# EAGLE design Probatio_Pogo (EAGLE 8.2.1)
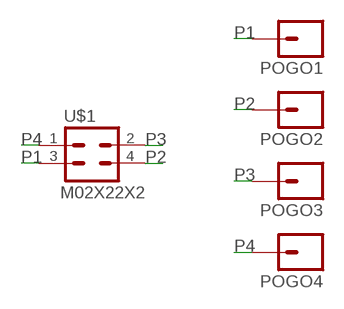
[diagram p0: schematic, sheet 1]

## Parts
POGO1  POGO_PIN0900-0-15-20-76-14-11-0  [POGO_PIN]
POGO2  POGO_PIN0900-0-15-20-76-14-11-0  [POGO_PIN]
POGO3  POGO_PIN0900-0-15-20-76-14-11-0  [POGO_PIN]
POGO4  POGO_PIN0900-0-15-20-76-14-11-0  [POGO_PIN]
U$1  M02X22X2  [2X2]

## Nets
P1: POGO1.P$1 U$1.3
P2: POGO2.P$1 U$1.4
P3: POGO3.P$1 U$1.2
P4: POGO4.P$1 U$1.1

## Library data of the parts
POGO1-POGO4 = Batebit:POGO_PIN
U$1 = Batebit:M02X2

## Net classes
0 default: width 0.4 mm, drill 0.8 mm, clearance 0.2 mm

## Board
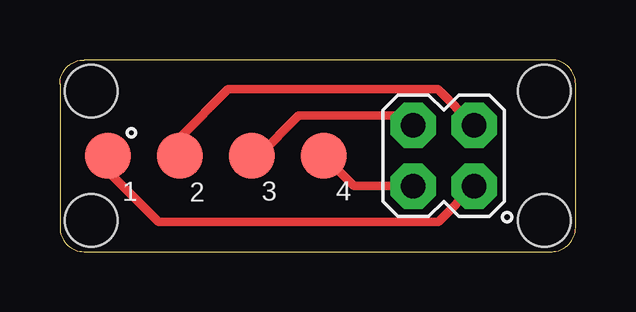
[diagram p1: board, top side]
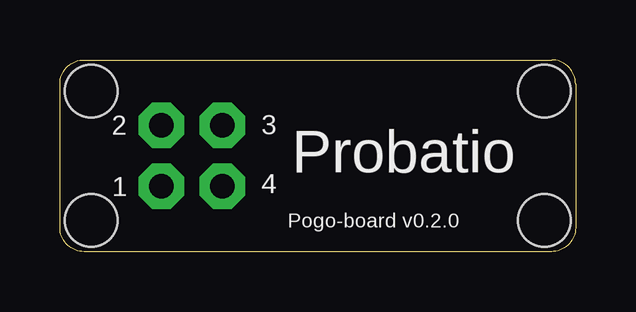
[diagram p2: board, bottom side, seen from below]

Size 21.5 x 8 mm. Coordinates in mm from the lower left corner, seen from the top.
Outline: 21.5,1 21.5,7 arc90 20.5,8 1,8 arc90 0,7 0,1 arc90 1,0 20.5,0 arc90 21.5,1
Copper layers (1*16): Top 0.035mm / dielectric 1.5mm / Bottom 0.035mm
Design rules "default *": minimum track width 8mil, minimum drill 0.35mm, track to track 8mil, track to pad 8mil, pad to pad 8mil, via to via 8mil, smd to smd 8mil, copper to edge 40mil, drill to drill 6mil, minimum pad ring 10mil, minimum via ring 8mil, stop-mask expansion 4mil, vias tented up to drill 0mil, thermal gap 10mil
Holes 2.2 mm at 20.2,1.3 20.2,6.7 1.3,6.7 1.3,1.3

### Footprints (pad centres in the part's own frame; a part is rotated, then mirrored left to right if it is on the bottom)
POGO_PIN = smd 1.9 x 1.9: P$1 0,0
2X2 = drill 1.016 pad 1.88 octagon: 1 -1.27,-1.27; 2 -1.27,1.27; 3 1.27,-1.27; 4 1.27,1.27

### Placement (x,y rotation side)
POGO1  2,4 0 top
POGO2  5,4 0 top
POGO3  8,4 0 top
POGO4  11,4 0 top
U$1  16,4 0 top

### Tracks (layer width: path | path; a pad name or v marks a point on that pad's centre or on a via)
P1
  Top 0.356: POGO1.P$1 2,3.35 4.11,1.24 15.78,1.24 U$1.3
P2
  Top 0.356: POGO2.P$1 5,4.76 7.02,6.78 15.76,6.78 U$1.4
P3
  Top 0.356: POGO3.P$1 8.28,4 9.95,5.67 14.33,5.67 U$1.2
P4
  Top 0.305: 14.71,2.75 U$1.1
  Top 0.356: POGO4.P$1 12.25,2.75 14.71,2.75

### Text on the board
tPlace: 1 | 2 | 3 | 4
bPlace: 3 | 2 | Probatio | 4 | 1 | Pogo-board v0.2.0